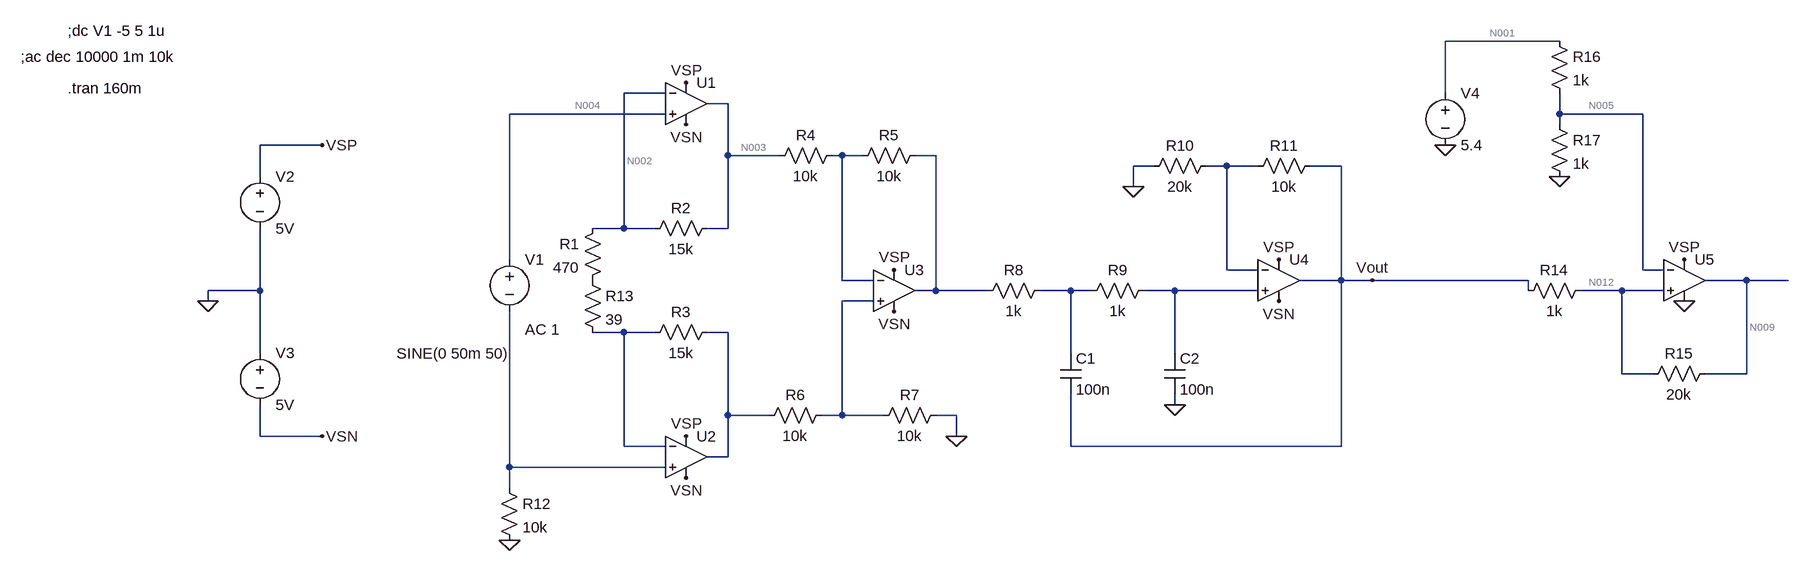
[diagram p0: schematic DEEA-6.asc]
DEEA-6.asc, the LTspice schematic file:
Version 4
SHEET 1 1876 804
WIRE 1520 16 1344 16
WIRE 144 96 80 96
WIRE 1344 96 1344 16
WIRE 240 112 208 112
WIRE 144 128 -96 128
WIRE 1520 128 1520 96
WIRE 1648 128 1520 128
WIRE 1520 144 1520 128
WIRE -384 176 -480 176
WIRE 240 192 240 112
WIRE 320 192 240 192
WIRE 416 192 400 192
WIRE 448 192 416 192
WIRE 560 192 528 192
WIRE 896 208 864 208
WIRE 1008 208 976 208
WIRE 1056 208 1008 208
WIRE 1184 208 1136 208
WIRE -480 224 -480 176
WIRE 864 240 864 208
WIRE 80 304 80 96
WIRE 80 304 32 304
WIRE 128 304 80 304
WIRE 240 304 240 192
WIRE 240 304 208 304
WIRE -96 352 -96 128
WIRE 1008 368 1008 208
WIRE 1056 368 1008 368
WIRE 1648 368 1648 128
WIRE 1680 368 1648 368
WIRE 416 384 416 192
WIRE 464 384 416 384
WIRE 1184 384 1184 208
WIRE 1184 384 1120 384
WIRE 1232 384 1184 384
WIRE 1472 384 1232 384
WIRE 1808 384 1744 384
WIRE 1872 384 1808 384
WIRE -480 400 -480 304
WIRE -480 400 -560 400
WIRE 560 400 560 192
WIRE 560 400 528 400
WIRE 640 400 560 400
WIRE 768 400 720 400
WIRE 800 400 768 400
WIRE 928 400 880 400
WIRE 1056 400 928 400
WIRE 1472 400 1472 384
WIRE 1616 400 1552 400
WIRE 1680 400 1616 400
WIRE -560 416 -560 400
WIRE 464 416 416 416
WIRE 80 464 32 464
WIRE 128 464 80 464
WIRE 240 464 208 464
WIRE -480 496 -480 400
WIRE 768 496 768 400
WIRE 928 496 928 400
WIRE 1616 528 1616 400
WIRE 1664 528 1616 528
WIRE 1808 528 1808 384
WIRE 1808 528 1744 528
WIRE 928 576 928 560
WIRE 240 592 240 464
WIRE 304 592 240 592
WIRE 416 592 416 416
WIRE 416 592 384 592
WIRE 480 592 416 592
WIRE 592 592 560 592
WIRE -480 624 -480 576
WIRE -384 624 -480 624
WIRE 592 624 592 592
WIRE 80 640 80 464
WIRE 144 640 80 640
WIRE 768 640 768 560
WIRE 1184 640 1184 384
WIRE 1184 640 768 640
WIRE 240 656 240 592
WIRE 240 656 208 656
WIRE -96 672 -96 432
WIRE 144 672 -96 672
WIRE -96 704 -96 672
FLAG 592 624 0
FLAG 928 576 0
FLAG 864 240 0
FLAG -96 784 0
FLAG -560 416 0
FLAG 176 80 VSP
FLAG 176 624 VSP
FLAG 496 368 VSP
FLAG 1088 352 VSP
FLAG -384 176 VSP
FLAG 176 144 VSN
FLAG 176 688 VSN
FLAG 496 432 VSN
FLAG 1088 416 VSN
FLAG -384 624 VSN
FLAG 1232 384 Vout
FLAG 1712 352 VSP
FLAG 1344 176 0
FLAG 1712 416 0
FLAG 1520 224 0
SYMBOL OpAmps\\UniversalOpAmp2 176 112 R0
SYMATTR InstName U1
SYMBOL OpAmps\\UniversalOpAmp2 176 656 R0
SYMATTR InstName U2
SYMBOL res 48 288 M0
SYMATTR InstName R1
SYMATTR Value 470
SYMBOL res 224 288 R90
WINDOW 0 0 56 VBottom 2
WINDOW 3 32 56 VTop 2
SYMATTR InstName R2
SYMATTR Value 15k
SYMBOL res 224 448 R90
WINDOW 0 0 56 VBottom 2
WINDOW 3 32 56 VTop 2
SYMATTR InstName R3
SYMATTR Value 15k
SYMBOL res 416 176 R90
WINDOW 0 0 56 VBottom 2
WINDOW 3 32 56 VTop 2
SYMATTR InstName R4
SYMATTR Value 10k
SYMBOL res 544 176 R90
WINDOW 0 0 56 VBottom 2
WINDOW 3 32 56 VTop 2
SYMATTR InstName R5
SYMATTR Value 10k
SYMBOL OpAmps\\UniversalOpAmp2 496 400 R0
SYMATTR InstName U3
SYMBOL res 400 576 R90
WINDOW 0 0 56 VBottom 2
WINDOW 3 32 56 VTop 2
SYMATTR InstName R6
SYMATTR Value 10k
SYMBOL res 576 576 R90
WINDOW 0 0 56 VBottom 2
WINDOW 3 32 56 VTop 2
SYMATTR InstName R7
SYMATTR Value 10k
SYMBOL res 736 384 R90
WINDOW 0 0 56 VBottom 2
WINDOW 3 32 56 VTop 2
SYMATTR InstName R8
SYMATTR Value 1k
SYMBOL res 896 384 R90
WINDOW 0 0 56 VBottom 2
WINDOW 3 32 56 VTop 2
SYMATTR InstName R9
SYMATTR Value 1k
SYMBOL cap 752 496 R0
SYMATTR InstName C1
SYMATTR Value 100n
SYMBOL cap 912 496 R0
SYMATTR InstName C2
SYMATTR Value 100n
SYMBOL OpAmps\\UniversalOpAmp2 1088 384 R0
SYMATTR InstName U4
SYMBOL res 992 192 R90
WINDOW 0 0 56 VBottom 2
WINDOW 3 32 56 VTop 2
SYMATTR InstName R10
SYMATTR Value 20k
SYMBOL res 1152 192 R90
WINDOW 0 0 56 VBottom 2
WINDOW 3 32 56 VTop 2
SYMATTR InstName R11
SYMATTR Value 10k
SYMBOL voltage -96 336 R0
WINDOW 3 -174 161 Left 2
WINDOW 123 24 124 Left 2
WINDOW 39 0 0 Left 0
SYMATTR Value SINE(0 50m 50)
SYMATTR Value2 AC 1
SYMATTR InstName V1
SYMBOL res -112 688 R0
SYMATTR InstName R12
SYMATTR Value 10k
SYMBOL voltage -480 208 R0
WINDOW 123 0 0 Left 0
WINDOW 39 0 0 Left 0
SYMATTR InstName V2
SYMATTR Value 5V
SYMBOL voltage -480 480 R0
WINDOW 123 0 0 Left 0
WINDOW 39 0 0 Left 0
SYMATTR InstName V3
SYMATTR Value 5V
SYMBOL res 16 368 R0
SYMATTR InstName R13
SYMATTR Value 39
SYMBOL OpAmps\\UniversalOpAmp2 1712 384 R0
SYMATTR InstName U5
SYMBOL res 1568 384 R90
WINDOW 0 0 56 VBottom 2
WINDOW 3 32 56 VTop 2
SYMATTR InstName R14
SYMATTR Value 1k
SYMBOL res 1760 512 R90
WINDOW 0 0 56 VBottom 2
WINDOW 3 32 56 VTop 2
SYMATTR InstName R15
SYMATTR Value 20k
SYMBOL voltage 1344 80 R0
WINDOW 123 0 0 Left 0
WINDOW 39 0 0 Left 0
SYMATTR InstName V4
SYMATTR Value 5.4
SYMBOL res 1504 0 R0
SYMATTR InstName R16
SYMATTR Value 1k
SYMBOL res 1504 128 R0
SYMATTR InstName R17
SYMATTR Value 1k
TEXT -776 0 Left 2 !;dc V1 -5 5 1u
TEXT -848 40 Left 2 !;ac dec 10000 1m 10k
TEXT -776 88 Left 2 !.tran 160m

The netlist it stands for:
* DEEA-6.asc
XU1 N004 N002 VSP VSN N003 level2 Avol=1Meg GBW=10Meg Slew=10Meg Ilimit=25m Rail=0 Vos=0 En=0 Enk=0 In=0 Ink=0 Rin=500Meg  ; pins In+ In- V+ V- OUT
XU2 N016 N014 VSP VSN N015 level2 Avol=1Meg GBW=10Meg Slew=10Meg Ilimit=25m Rail=0 Vos=0 En=0 Enk=0 In=0 Ink=0 Rin=500Meg  ; pins In+ In- V+ V- OUT
R1 N002 P001 470
R2 N003 N002 15k
R3 N015 N014 15k
R4 N006 N003 10k
R5 N007 N006 10k
XU3 N013 N006 VSP VSN N007 level2 Avol=1Meg GBW=10Meg Slew=10Meg Ilimit=25m Rail=0 Vos=0 En=0 Enk=0 In=0 Ink=0 Rin=500Meg  ; pins In+ In- V+ V- OUT
R6 N013 N015 10k
R7 0 N013 10k
R8 N010 N007 1k
R9 N011 N010 1k
C1 N010 Vout 100n
C2 N011 0 100n
XU4 N011 N008 VSP VSN Vout level2 Avol=1Meg GBW=10Meg Slew=10Meg Ilimit=25m Rail=0 Vos=0 En=0 Enk=0 In=0 Ink=0 Rin=500Meg  ; pins In+ In- V+ V- OUT
R10 N008 0 20k
R11 Vout N008 10k
V1 N004 N016 SINE(0 50m 50) AC 1
R12 N016 0 10k
V2 VSP 0 5V
V3 0 VSN 5V
R13 P001 N014 39
XU5 N012 N005 VSP 0 N009 level2 Avol=1Meg GBW=10Meg Slew=10Meg Ilimit=25m Rail=0 Vos=0 En=0 Enk=0 In=0 Ink=0 Rin=500Meg  ; pins In+ In- V+ V- OUT
R14 N012 Vout 1k
R15 N009 N012 20k
V4 N001 0 5.4
R16 N001 N005 1k
R17 N005 0 1k
;dc V1 -5 5 1u
;ac dec 10000 1m 10k
.tran 160m
.lib UniversalOpAmp2.lib
.backanno
.end

* Results of the author's LTspice run, read from the files saved beside the schematic
* Operating Point, zero values left out:
*   V(vsp) = 5 V
*   V(vsn) = -5 V
*   V(n009) = 5.363 µV
*   V(n005) = 2.7 V
*   V(n012) = 5.017 µV
*   V(n001) = 5.4 V
*   I(R14) = 5.017 nA
*   I(R15) = 17.31 pA
*   I(R16) = 2.7 mA
*   I(R17) = 2.7 mA
*   I(V2) = -2 mA
*   I(V3) = -2 mA
*   I(V4) = -2.7 mA
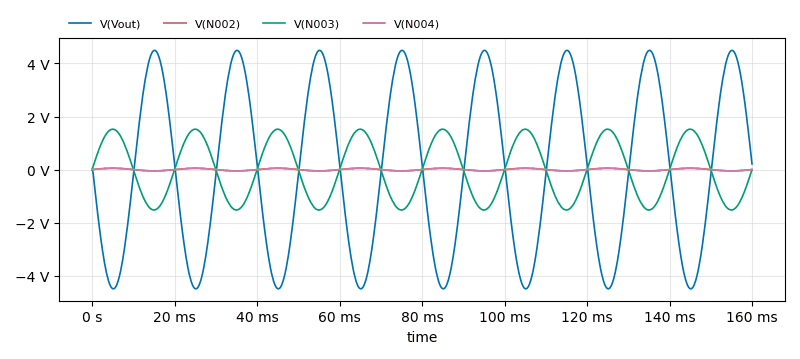
[diagram p1: Transient Analysis of DEEA-6.asc, plotted from the saved traces]
* Transient Analysis, 1 run:
*   V(Vout): min -4.492 V, max 4.492 V, average 185.7 µV, rms 3.177 V, last 213.2 mV
*   V(N002): min -49.97 mV, max 49.97 mV, average -3.223 µV, rms 35.34 mV, last -7.688 µV
*   V(N003): min -1.522 V, max 1.522 V, average -98.2 µV, rms 1.077 V, last -452.9 µV
*   V(N004): min -50 mV, max 50 mV, average -2.465 µV, rms 35.37 mV, last 0 V